# EAGLE design B142A (EAGLE 6.6.0)
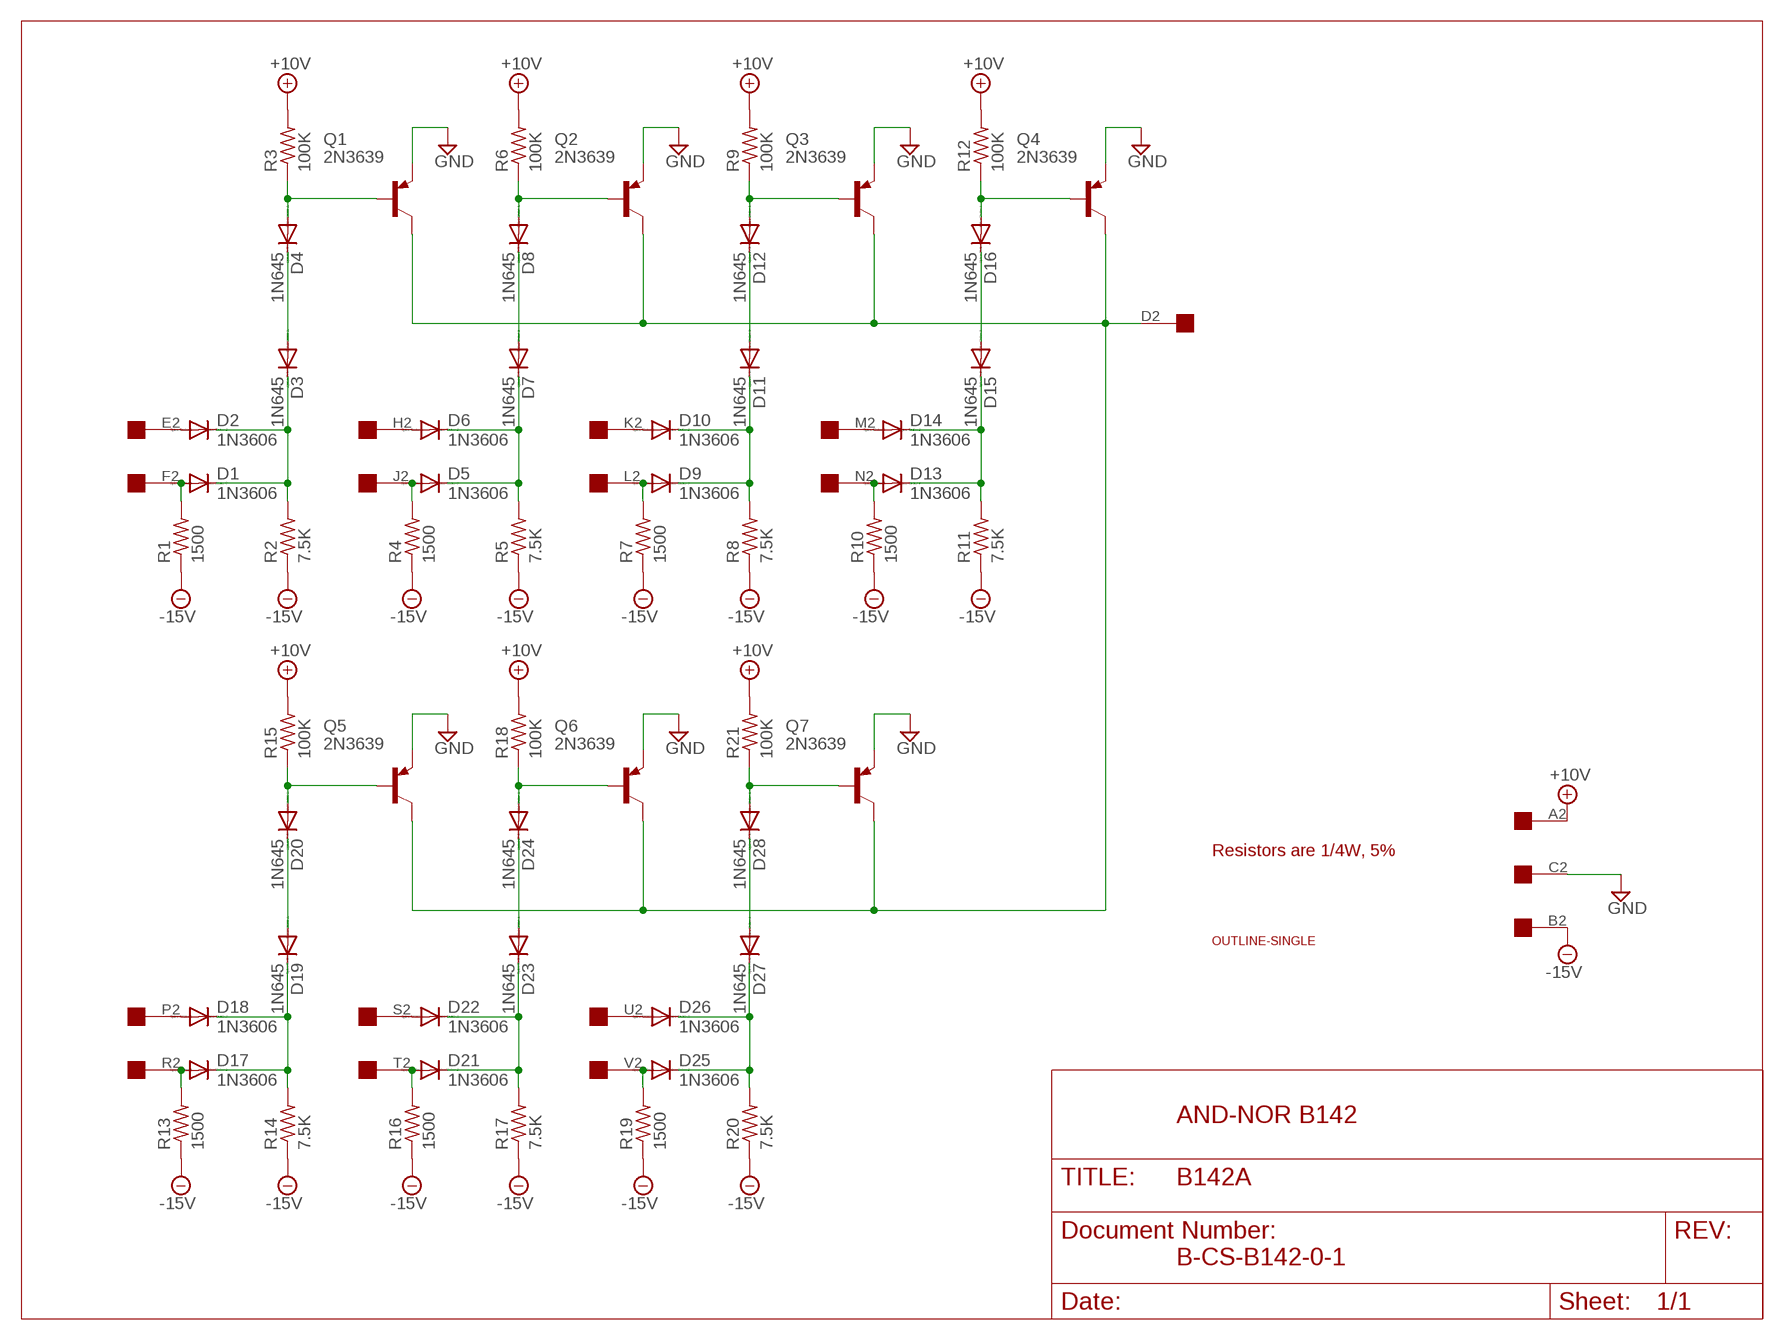
[diagram p0: schematic, sheet 1]

## Parts
D1  1N3606  1N4148DO35-10  [DO35-10]
D2  1N3606  1N4148DO35-10  [DO35-10]
D3  1N645  1N4148DO35-10  [DO35-10]
D4  1N645  1N4148DO35-10  [DO35-10]
D5  1N3606  1N4148DO35-10  [DO35-10]
D6  1N3606  1N4148DO35-10  [DO35-10]
D7  1N645  1N4148DO35-10  [DO35-10]
D8  1N645  1N4148DO35-10  [DO35-10]
D9  1N3606  1N4148DO35-10  [DO35-10]
D10  1N3606  1N4148DO35-10  [DO35-10]
D11  1N645  1N4148DO35-10  [DO35-10]
D12  1N645  1N4148DO35-10  [DO35-10]
D13  1N3606  1N4148DO35-10  [DO35-10]
D14  1N3606  1N4148DO35-10  [DO35-10]
D15  1N645  1N4148DO35-10  [DO35-10]
D16  1N645  1N4148DO35-10  [DO35-10]
D17  1N3606  1N4148DO35-10  [DO35-10]
D18  1N3606  1N4148DO35-10  [DO35-10]
D19  1N645  1N4148DO35-10  [DO35-10]
D20  1N645  1N4148DO35-10  [DO35-10]
D21  1N3606  1N4148DO35-10  [DO35-10]
D22  1N3606  1N4148DO35-10  [DO35-10]
D23  1N645  1N4148DO35-10  [DO35-10]
D24  1N645  1N4148DO35-10  [DO35-10]
D25  1N3606  1N4148DO35-10  [DO35-10]
D26  1N3606  1N4148DO35-10  [DO35-10]
D27  1N645  1N4148DO35-10  [DO35-10]
D28  1N645  1N4148DO35-10  [DO35-10]
Q1  2N3639  2N3637  [TO39]
Q2  2N3639  2N3637  [TO39]
Q3  2N3639  2N3637  [TO39]
Q4  2N3639  2N3637  [TO39]
Q5  2N3639  2N3637  [TO39]
Q6  2N3639  2N3637  [TO39]
Q7  2N3639  2N3637  [TO39]
R1  1500  R-US_0207/10  [0207/10]
R2  7.5K  R-US_0207/10  [0207/10]
R3  100K  R-US_0207/10  [0207/10]
R4  1500  R-US_0207/10  [0207/10]
R5  7.5K  R-US_0207/10  [0207/10]
R6  100K  R-US_0207/10  [0207/10]
R7  1500  R-US_0207/10  [0207/10]
R8  7.5K  R-US_0207/10  [0207/10]
R9  100K  R-US_0207/10  [0207/10]
R10  1500  R-US_0207/10  [0207/10]
R11  7.5K  R-US_0207/10  [0207/10]
R12  100K  R-US_0207/10  [0207/10]
R13  1500  R-US_0207/10  [0207/10]
R14  7.5K  R-US_0207/10  [0207/10]
R15  100K  R-US_0207/10  [0207/10]
R16  1500  R-US_0207/10  [0207/10]
R17  7.5K  R-US_0207/10  [0207/10]
R18  100K  R-US_0207/10  [0207/10]
R19  1500  R-US_0207/10  [0207/10]
R20  7.5K  R-US_0207/10  [0207/10]
R21  100K  R-US_0207/10  [0207/10]
U$1  OUTLINE-SINGLE  [SINGLE]
U$2  EDGE-1  [EDGE-CON1]

## Nets
+10V [Power]: R3.2 R6.2 R9.2 R12.2 R15.2 R18.2 R21.2 U$2.A2
-15V [Power]: R1.1 R2.1 R4.1 R5.1 R7.1 R8.1 R10.1 R11.1 R13.1 R14.1 R16.1 R17.1 R19.1 R20.1 U$2.B2
GND [Power]: Q1.1(E) Q2.1(E) Q3.1(E) Q4.1(E) Q5.1(E) Q6.1(E) Q7.1(E) U$2.C2
N$1: D22.A U$2.S2
N$2: D4.A Q1.2(B) R3.1
N$3: D3.A D4.C
N$4: Q1.3(C) Q2.3(C) Q3.3(C) Q4.3(C) Q5.3(C) Q6.3(C) Q7.3(C) U$2.D2
N$5: D5.A R4.2 U$2.J2
N$6: D12.A Q3.2(B) R9.1
N$7: D10.A U$2.K2
N$8: D26.A U$2.U2
N$9: D14.A U$2.M2
N$10: D9.A R7.2 U$2.L2
N$11: D8.A Q2.2(B) R6.1
N$12: D18.A U$2.P2
N$13: D11.A D12.C
N$14: D25.A R19.2 U$2.V2
N$15: D16.A Q4.2(B) R12.1
N$16: D25.C D26.C D27.C R20.2
N$17: D15.A D16.C
N$18: D1.C D2.C D3.C R2.2
N$19: D5.C D6.C D7.C R5.2
N$20: D2.A U$2.E2
N$21: D1.A R1.2 U$2.F2
N$22: D7.A D8.C
N$23: D6.A U$2.H2
N$24: D13.C D14.C D15.C R11.2
N$25: D17.C D18.C D19.C R14.2
N$26: D13.A R10.2 U$2.N2
N$27: D20.A Q5.2(B) R15.1
N$28: D21.C D22.C D23.C R17.2
N$29: D9.C D10.C D11.C R8.2
N$31: D17.A R13.2 U$2.R2
N$32: D19.A D20.C
N$33: D24.A Q6.2(B) R18.1
N$34: D23.A D24.C
N$35: D28.A Q7.2(B) R21.1
N$36: D21.A R16.2 U$2.T2
N$37: D27.A D28.C

## Notes on the sheet
- Resistors are 1/4W, 5%
- AND-NOR B142
- B-CS-B142-0-1

## Library data of the parts
D1-D28 = diode:1N4148: DIODE high speed (Philips)
Q1-Q7 = transistor-pnp:2N3637*: PNP Transistror
R1-R21 = rcl:R-US_: RESISTOR, American symbol
U$1 = dec-con:OUTLINE-*: Board outlines for DEC boards.
U$2 = dec-con:EDGE-1: Single-Sided DEC Edge Connector -- (side 2)

## Net classes
1 Power: width 0.813 mm

## Board
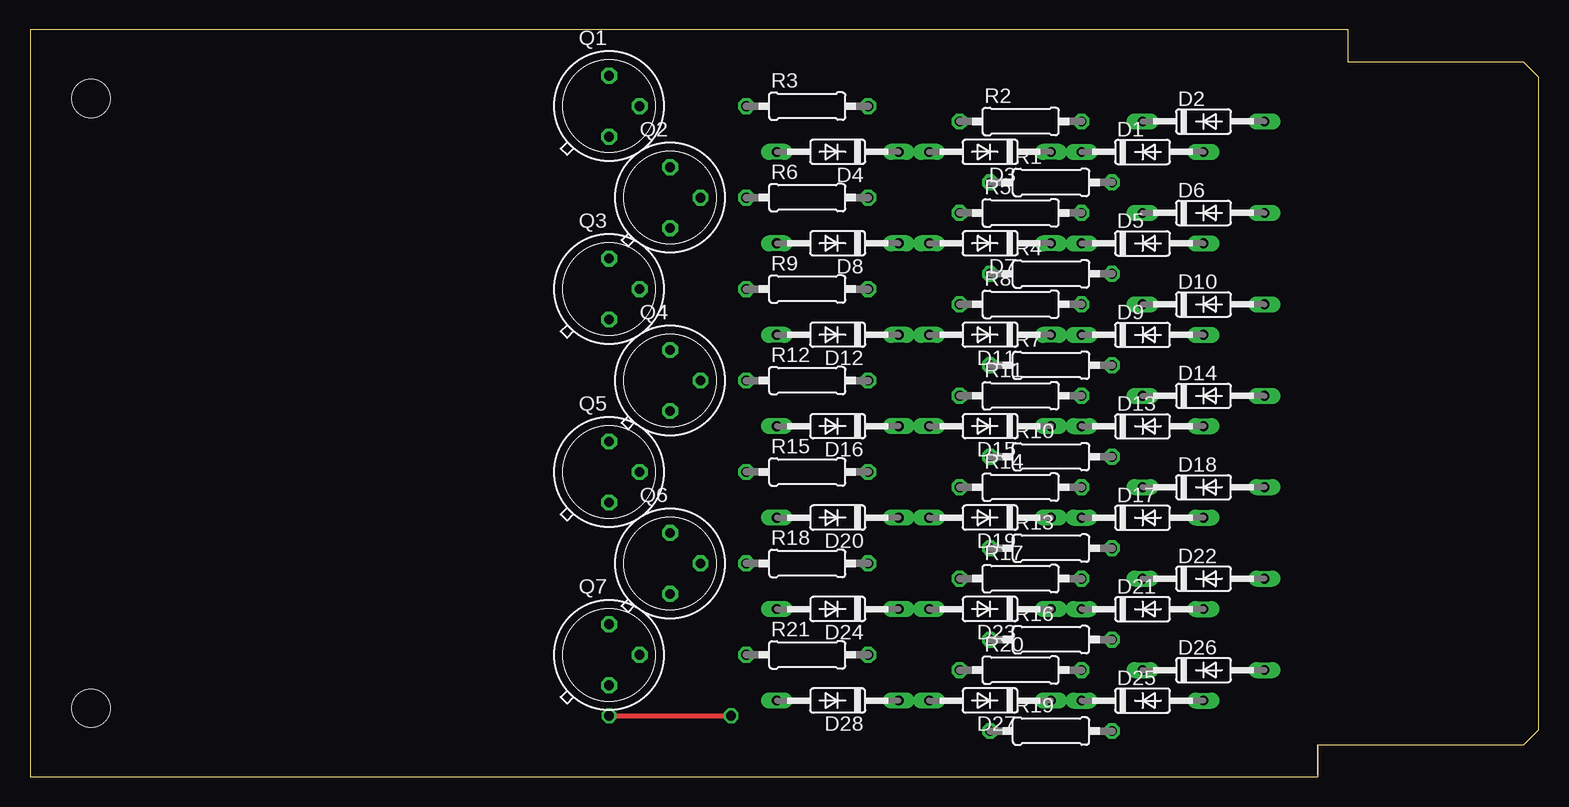
[diagram p1: board, top side]
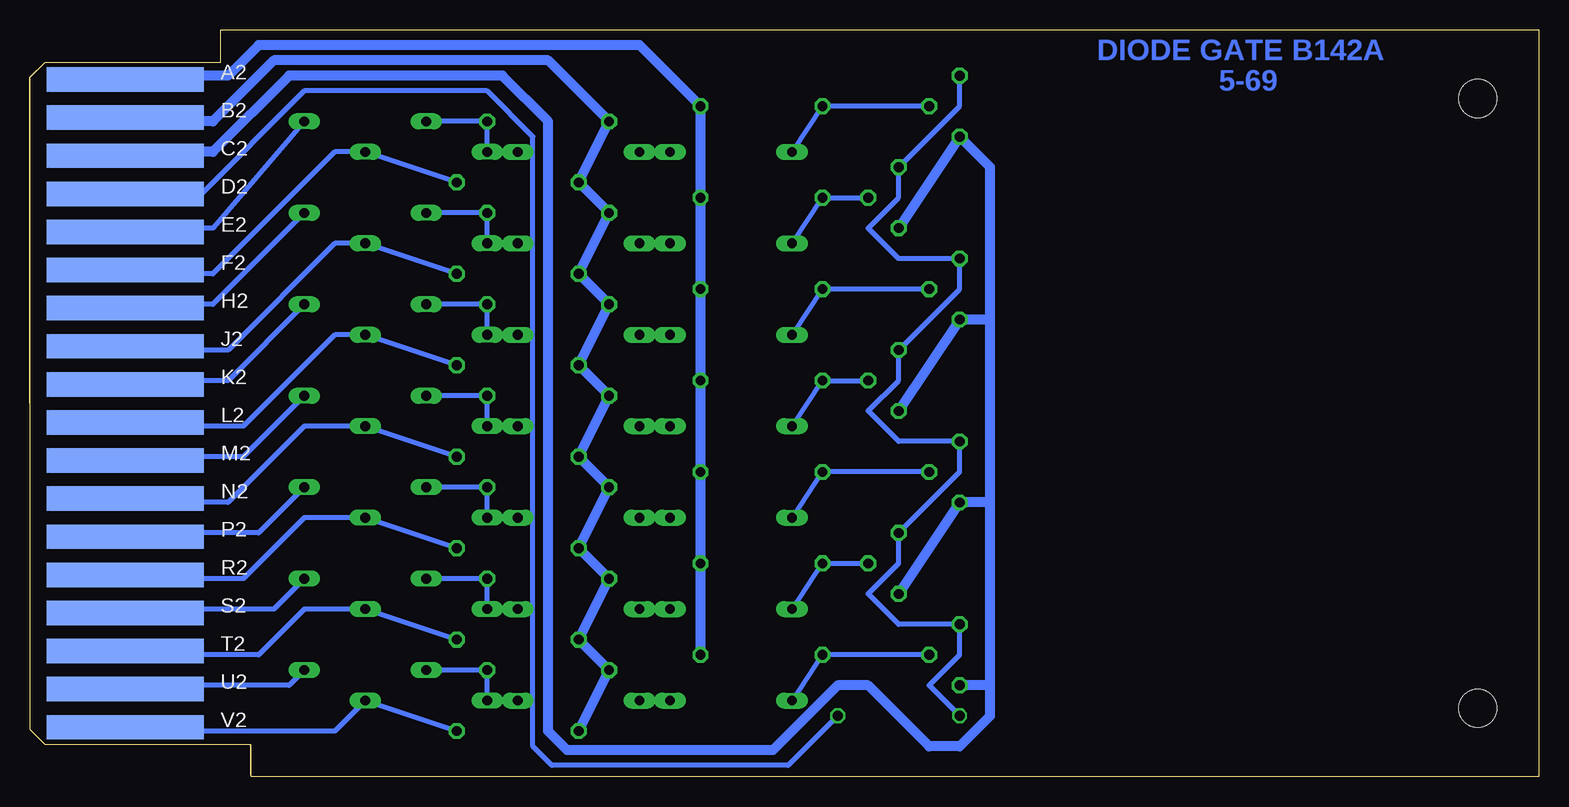
[diagram p2: board, bottom side, seen from below]

Size 125.73 x 62.23 mm. Coordinates in mm from the lower left corner, seen from the top.
Copper layers (1+16): Top 0.035mm / dielectric 1.5mm / Bottom 0.035mm
Design rules "16mils": minimum track width 16mil, minimum drill 32mil, track to track 15mil, track to pad 10mil, pad to pad 10mil, via to via 10mil, smd to smd 10mil, copper to edge 13mil, drill to drill 10mil, minimum pad ring 10mil, minimum via ring 8mil, stop-mask expansion 0mil, vias tented up to drill 0mil, thermal gap 10mil

### Footprints (pad centres in the part's own frame; a part is rotated, then mirrored left to right if it is on the bottom)
DO35-10 = drill 0.813 long: A 5.08,0; C -5.08,0
TO39 = drill 0.813 octagon: 1 0,-2.54; 2 2.54,0; 3 0,2.54
0207/10 = drill 0.813 octagon: 1 -5.08,0; 2 5.08,0
SINGLE = hole 3.175: 120.65,56.515; 120.65,5.715
EDGE-CON1 = smd 13.106 x 2.032 bottom: A2 7.938,4.128; B2 7.938,7.303; C2 7.938,10.477; D2 7.938,13.652; E2 7.938,16.828; F2 7.938,20.003; H2 7.938,23.177; J2 7.938,26.352; K2 7.938,29.527; L2 7.938,32.703; M2 7.938,35.877; N2 7.938,39.053; P2 7.938,42.227; R2 7.938,45.403; S2 7.938,48.578; T2 7.938,51.752; U2 7.938,54.928; V2 7.938,58.102

### Placement (x,y rotation side)
D1  92.71,52.07 0 top
D2  97.79,54.61 0 top
D3  80.01,52.07 180 top
D4  67.31,52.07 180 top
D5  92.71,44.45 0 top
D6  97.79,46.99 0 top
D7  80.01,44.45 180 top
D8  67.31,44.45 180 top
D9  92.71,36.83 0 top
D10  97.79,39.37 0 top
D11  80.01,36.83 180 top
D12  67.31,36.83 180 top
D13  92.71,29.21 0 top
D14  97.79,31.75 0 top
D15  80.01,29.21 180 top
D16  67.31,29.21 180 top
D17  92.71,21.59 0 top
D18  97.79,24.13 0 top
D19  80.01,21.59 180 top
D20  67.31,21.59 180 top
D21  92.71,13.97 0 top
D22  97.79,16.51 0 top
D23  80.01,13.97 180 top
D24  67.31,13.97 180 top
D25  92.71,6.35 0 top
D26  97.79,8.89 0 top
D27  80.01,6.35 180 top
D28  67.31,6.35 180 top
Q1  48.26,55.88 0 top
Q2  53.34,48.26 0 top
Q3  48.26,40.64 0 top
Q4  53.34,33.02 0 top
Q5  48.26,25.4 0 top
Q6  53.34,17.78 0 top
Q7  48.26,10.16 0 top
R1  85.09,49.53 0 top
R2  82.55,54.61 0 top
R3  64.77,55.88 0 top
R4  85.09,41.91 0 top
R5  82.55,46.99 0 top
R6  64.77,48.26 0 top
R7  85.09,34.29 0 top
R8  82.55,39.37 0 top
R9  64.77,40.64 0 top
R10  85.09,26.67 0 top
R11  82.55,31.75 0 top
R12  64.77,33.02 0 top
R13  85.09,19.05 0 top
R14  82.55,24.13 0 top
R15  64.77,25.4 0 top
R16  85.09,11.43 0 top
R17  82.55,16.51 0 top
R18  64.77,17.78 0 top
R19  85.09,3.81 0 top
R20  82.55,8.89 0 top
R21  64.77,10.16 0 top
U$1  125.73,62.23 180 top
U$2  125.73,62.23 180 top

### Tracks (layer width: path | path; a pad name or v marks a point on that pad's centre or on a via)
+10V
  Bottom 0.813: U$2.A2 114.68,58.04 114.3,58.42 109.22,58.42 106.68,60.96 74.93,60.96 R3.2 R6.2 R9.2 R12.2 R15.2 R18.2 R21.2
-15V
  Bottom 0.813: U$2.B2 115.86,54.9 115.57,54.61 110.49,54.61 105.41,59.69 82.55,59.69 R2.1 R1.1 R5.1 R4.1 R8.1 R7.1 R11.1 R10.1 R14.1 R13.1 R17.1 R16.1 R20.1 R19.1
GND
  Bottom 0.813: U$2.C2 117.17,51.74 116.84,52.07 110.49,52.07 104.14,58.42 86.36,58.42 82.55,54.61 82.55,3.81 80.96,2.22 63.82,2.22 58.42,7.62 55.88,7.62 50.8,2.54 48.26,2.54 45.72,5.08 45.72,7.62 | 45.72,7.62 45.72,22.86 | 45.72,22.86 45.72,38.1 | 45.72,38.1 45.72,50.8 Q1.1 Q2.1 | Q4.1 Q3.1 45.72,38.1 | Q6.1 Q5.1 45.72,22.86 | 45.72,7.62 Q7.1
N$1
  Bottom 0.406: U$2.S2 117.14,13.66 116.84,13.97 105.41,13.97 D22.A
N$2
  Bottom 0.406: Q1.2 R3.1 D4.A
N$3
  Bottom 0.406: D4.C D3.A
N$4  (via drill 0.81)
  Top 0.406: v48.26,5.08 v58.42,5.08
  Bottom 0.406: U$2.D2 117.14,48.56 116.84,48.26 111.76,48.26 102.87,57.15 87.63,57.15 83.82,53.34 83.82,2.54 82.23,0.95 62.55,0.95 v58.42,5.08 | Q1.3 48.26,55.88 Q2.3 53.34,48.26 55.88,45.72 53.34,43.18 Q3.3 48.26,40.64 Q4.3 53.34,33.02 55.88,30.48 53.34,27.94 Q5.3 48.26,25.4 Q6.3 53.34,17.78 55.88,15.24 53.34,12.7 Q7.3 48.26,10.16 50.8,7.62 v48.26,5.08
N$5
  Bottom 0.406: R4.2 D5.A 100.33,44.45 109.22,35.56 115.57,35.56 115.9,35.89 U$2.J2
N$6
  Bottom 0.406: Q3.2 R9.1 D12.A
N$7
  Bottom 0.406: U$2.K2 117.14,32.72 116.84,33.02 109.22,33.02 D10.A
N$8
  Bottom 0.406: U$2.U2 117.2,7.26 116.84,7.62 104.14,7.62 D26.A
N$9
  Bottom 0.406: U$2.M2 117.17,26.34 116.84,26.67 107.95,26.67 D14.A
N$10
  Bottom 0.406: R7.2 D9.A 100.33,36.83 107.95,29.21 116.84,29.21 117.17,29.54 U$2.L2
N$11
  Bottom 0.406: Q2.2 R6.1 D8.A
N$12
  Bottom 0.406: U$2.P2 117.17,19.99 116.84,20.32 106.68,20.32 D18.A
N$13
  Bottom 0.406: D12.C D11.A
N$14
  Bottom 0.406: U$2.V2 115.89,4.13 115.57,3.81 100.33,3.81 D25.A R19.2
N$15
  Bottom 0.406: Q4.2 R12.1 D16.A
N$16
  Bottom 0.406: D26.C R20.2 D25.C D27.C
N$17
  Bottom 0.406: D16.C D15.A
N$18
  Bottom 0.406: D2.C R2.2 D1.C D3.C
N$19
  Bottom 0.406: D7.C D5.C R5.2 D6.C
N$20
  Bottom 0.406: U$2.E2 117.17,45.39 116.84,45.72 110.49,45.72 D2.A
N$21
  Bottom 0.406: R1.2 D1.A 100.33,52.07 110.49,41.91 116.84,41.91 117.12,42.19 U$2.F2
N$22
  Bottom 0.406: D8.C D7.A
N$23
  Bottom 0.406: U$2.H2 117.17,39.04 116.84,39.37 110.49,39.37 D6.A
N$24
  Bottom 0.406: D15.C D13.C R11.2 D14.C
N$25
  Bottom 0.406: D19.C D17.C R14.2 D18.C
N$26
  Bottom 0.406: R10.2 D13.A 102.87,29.21 109.22,22.86 116.84,22.86 117.17,23.19 U$2.N2
N$27
  Bottom 0.406: D20.A R15.1 Q5.2
N$28
  Bottom 0.406: D23.C D21.C R17.2 D22.C
N$29
  Bottom 0.406: D11.C D9.C R8.2 D10.C
N$31
  Bottom 0.406: R13.2 D17.A 102.87,21.59 107.95,16.51 116.84,16.51 117.17,16.84 U$2.R2
N$32
  Bottom 0.406: D20.C D19.A
N$33
  Bottom 0.406: D24.A R18.1 Q6.2
N$34
  Bottom 0.406: D24.C D23.A
N$35
  Bottom 0.406: Q7.2 R21.1 D28.A
N$36
  Bottom 0.406: R16.2 D21.A 102.87,13.97 106.68,10.16 116.84,10.16 117.17,10.49 U$2.T2
N$37
  Bottom 0.406: D28.C D27.A

### Text on the board
Bottom: DIODE GATE B142A | 5-69